# EAGLE design encoder (EAGLE 7.7.0)
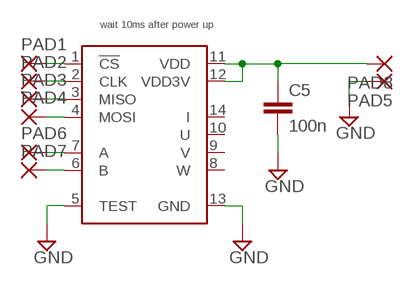
[diagram p0: schematic, sheet 1]

## Parts
C5  100n  C-EUC0603  [C0603]
PAD1  SMD2  [SMD1,27-2,54]
PAD2  SMD2  [SMD1,27-2,54]
PAD3  SMD2  [SMD1,27-2,54]
PAD4  SMD2  [SMD1,27-2,54]
PAD5  SMD2  [SMD1,27-2,54]
PAD6  SMD2  [SMD1,27-2,54]
PAD7  SMD2  [SMD1,27-2,54]
PAD8  SMD2  [SMD1,27-2,54]
U$1  AS5147P  [TSSOP-14]

## Nets
A: PAD6.1(P) U$1.7(A)
B: PAD7.1(P) U$1.6(B)
CLK: PAD2.1(P) U$1.2(CLK)
CS: PAD1.1(P) U$1.1(!CS)
GND: C5.2 PAD5.1(P) U$1.5(TEST) U$1.13(GND)
MISO: PAD3.1(P) U$1.3(MISO)
MOSI: PAD4.1(P) U$1.4(MOSI)
VCC: C5.1 PAD8.1(P) U$1.11(VDD) U$1.12(VDD3V)
Unconnected: U$1.8(W) U$1.9(V) U$1.10(U) U$1.14(I)

## Notes on the sheet
- wait 10ms after power up

## Library data of the parts
C5 = rcl:C-EU: CAPACITOR, European symbol
PAD1-PAD8 = wirepad:SMD2: SMD PAD
U$1 = ams:AS5147P

## Board
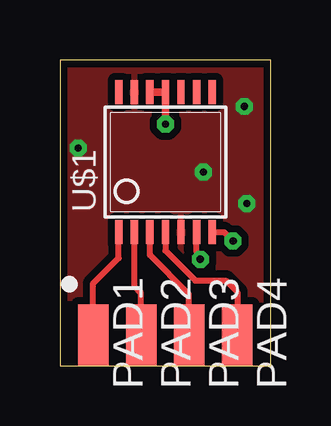
[diagram p1: board, top side]
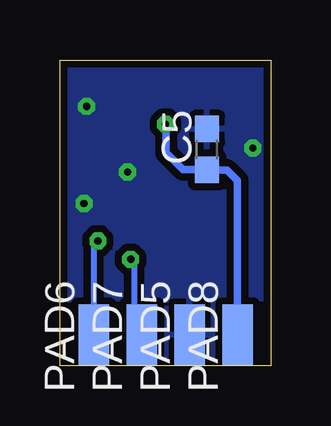
[diagram p2: board, bottom side, seen from below]

Size 8.81 x 12.76 mm. Coordinates in mm from the lower left corner, seen from the top.
Outline: 0,0 8.81,0 8.81,12.76 0,12.76 0,0
Copper layers (1*16): Top 0.035mm / dielectric 1.5mm / Bottom 0.035mm
Design rules "default *": minimum track width 10mil, minimum drill 24mil, track to track 8mil, track to pad 8mil, pad to pad 8mil, via to via 8mil, smd to smd 8mil, copper to edge 1mil, drill to drill 8mil, minimum pad ring 10mil, minimum via ring 8mil, stop-mask expansion 4mil, vias tented up to drill 0mil, thermal gap 10mil

### Footprints (pad centres in the part's own frame; a part is rotated, then mirrored left to right if it is on the bottom)
C0603 = smd 1.1 x 1: 1 -0.85,0; 2 0.85,0
SMD1,27-2,54 = smd 1.27 x 2.54: 1 0,0
TSSOP-14 = smd 0.991 x 0.305: 1 -2.918,1.95; 2 -2.918,1.3; 3 -2.918,0.65; 4 -2.918,0; 5 -2.918,-0.65; 6 -2.918,-1.3; 7 -2.918,-1.95; 8 2.918,-1.95; 9 2.918,-1.3; 10 2.918,-0.65; 11 2.918,0; 12 2.918,0.65; 13 2.918,1.3; 14 2.918,1.95

### Placement (x,y rotation side)
C5  2.67,9.03 90 bottom
PAD1  1.4,1.3 180 top
PAD2  3.4,1.3 180 top
PAD3  5.4,1.3 180 top
PAD4  7.4,1.3 180 top
PAD5  3.4,1.3 0 bottom
PAD6  7.39,1.3 0 bottom
PAD7  5.4,1.3 0 bottom
PAD8  1.4,1.3 0 bottom
U$1  4.4,8.5 90 top

### Tracks (layer width: path | path; a pad name or v marks a point on that pad's centre or on a via)
A  (via drill 0.3)
  Top 0.254: U$1.7 6.85,5.58 v7.23,5.21
  Bottom 0.254: v7.23,5.21 7.39,5.04 PAD6.1
B  (via drill 0.3)
  Top 0.254: U$1.6 5.71,4.75 5.86,4.6 v5.86,4.45
  Bottom 0.254: v5.86,4.45 5.71,4.3 5.71,2.29 5.65,2.29 5.65,1.3 PAD7.1
CLK
  Top 0.254: U$1.2 3.11,3.31 3.37,3.05 3.37,1.33 PAD2.1
  Top 0.305: U$1.2 3.11,5.58
CS
  Top 0.254: 1.38,1.31 1.38,3.43 2.46,4.5 U$1.1
  Top 0.305: U$1.1 | PAD1.1 1.38,1.31
GND  (via drill 0.3)
  other vias: 7.7,10.82 5.98,8.09 7.81,6.77 0.76,9.08
  pour Top (isolate 0.305): -1,13 10,13 10,-1 -1,-1
  pour Bottom (isolate 0.305): -1,13 10,13 10,-1 -1,-1
MISO
  Top 0.254: U$1.3 3.75,4.62 5.37,3 5.37,1.3 PAD3.1 | PAD3.1 | 4.89,1.81 PAD3.1
MOSI
  Top 0.254: 4.38,5.56 U$1.4 4.4,4.8 5.65,3.56 6.92,3.56 7.4,3.08 PAD4.1
VCC  (via drill 0.3)
  Top 0.305: v4.41,10.08 4.41,10.46 4.4,10.47 U$1.11 U$1.12
  Bottom 0.305: v4.41,10.08 4.38,10.06 4.38,8.89 3.67,8.18 C5.1 1.85,8.17 1.4,7.72 PAD8.1